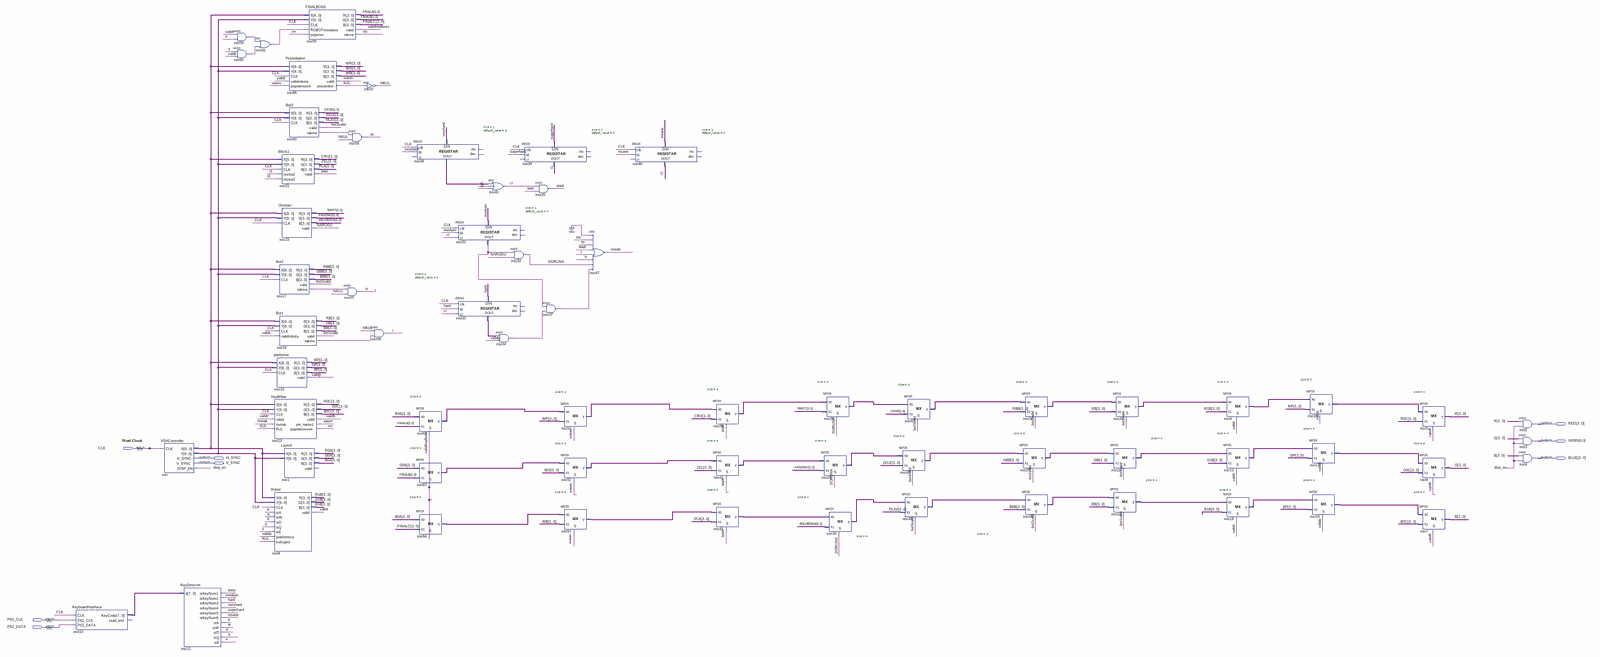
[diagram p0: schematic sheet, whole]
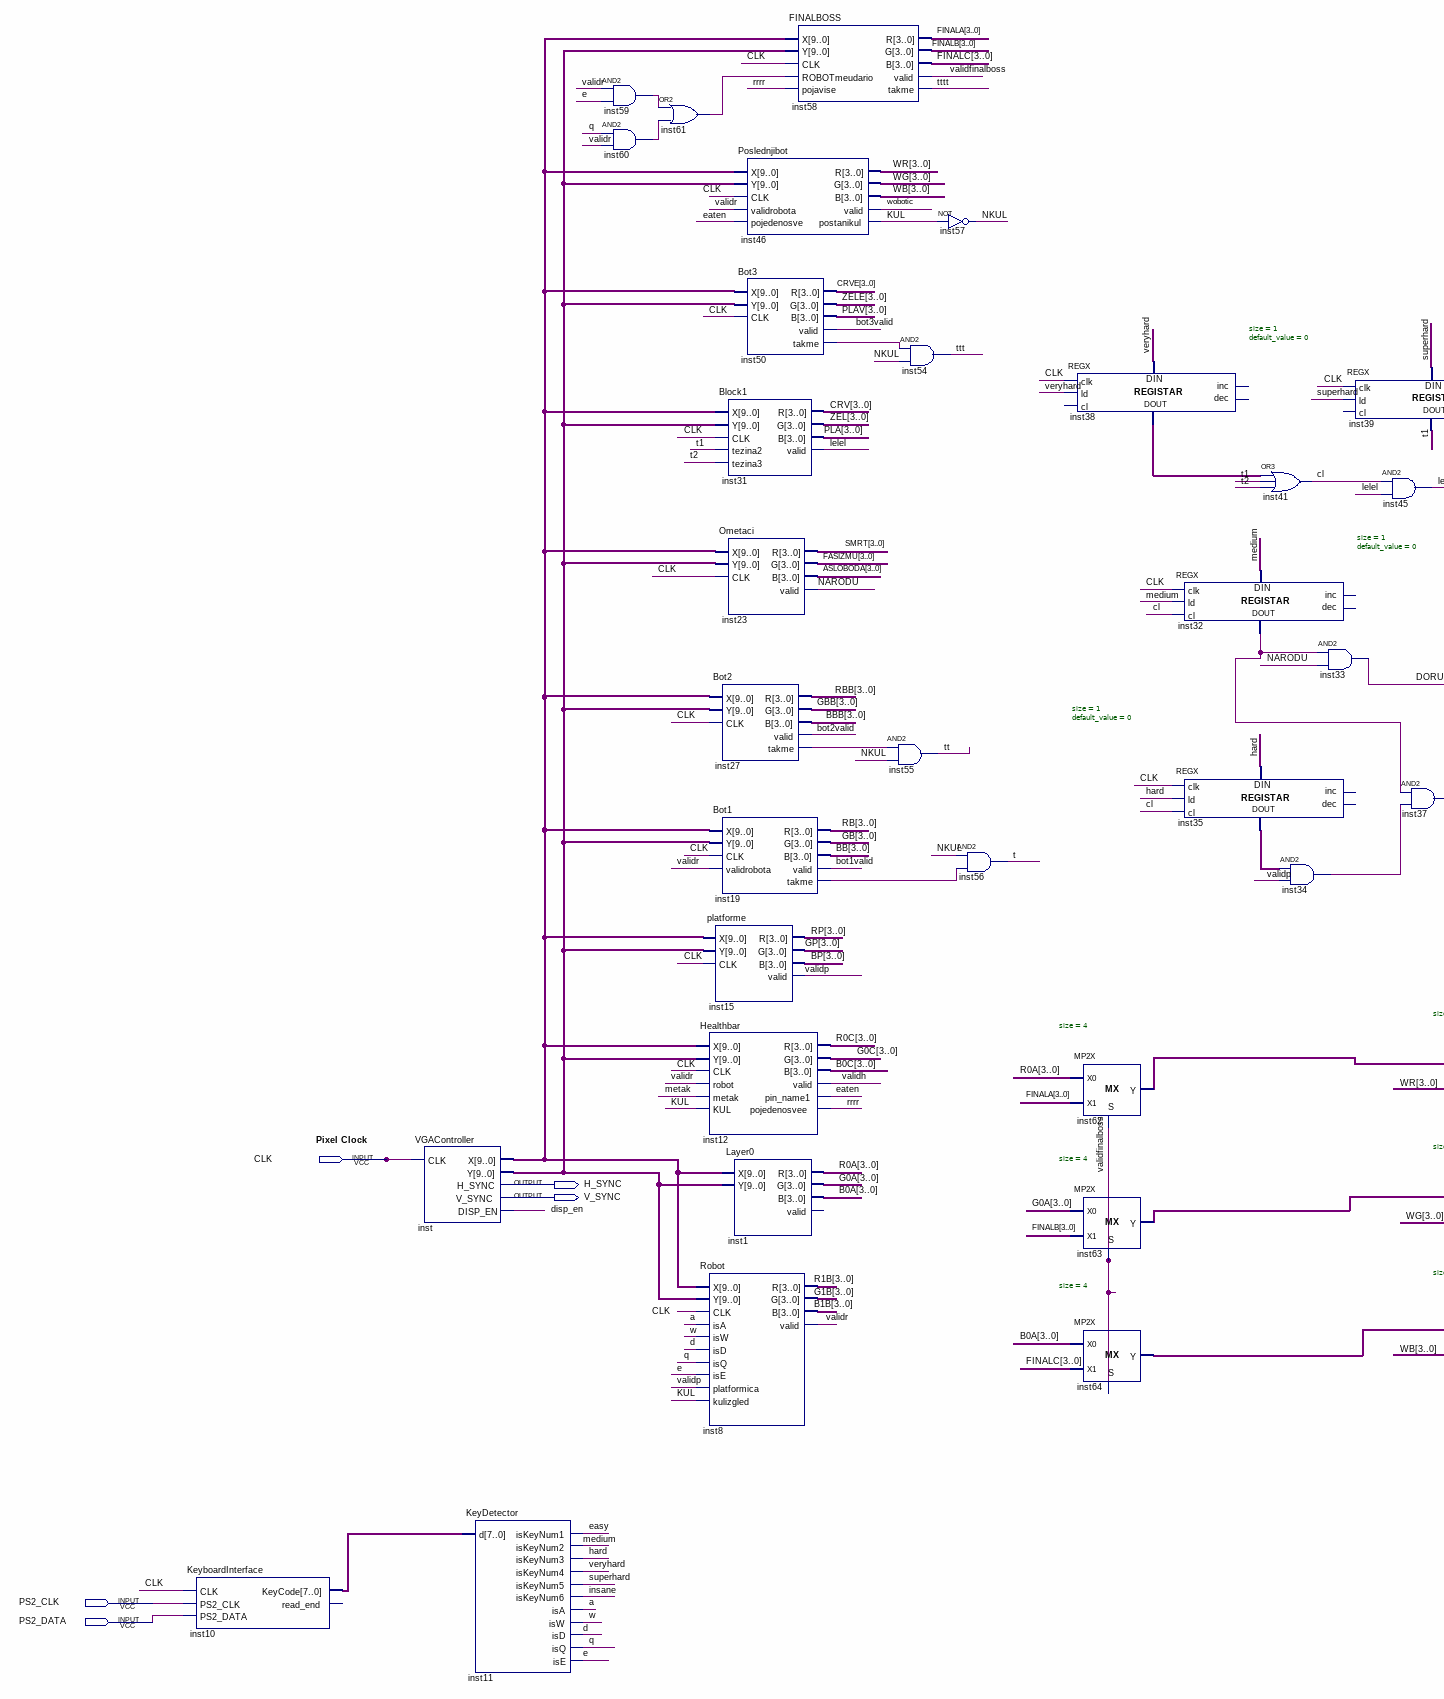
[diagram p1: schematic sheet, left part]
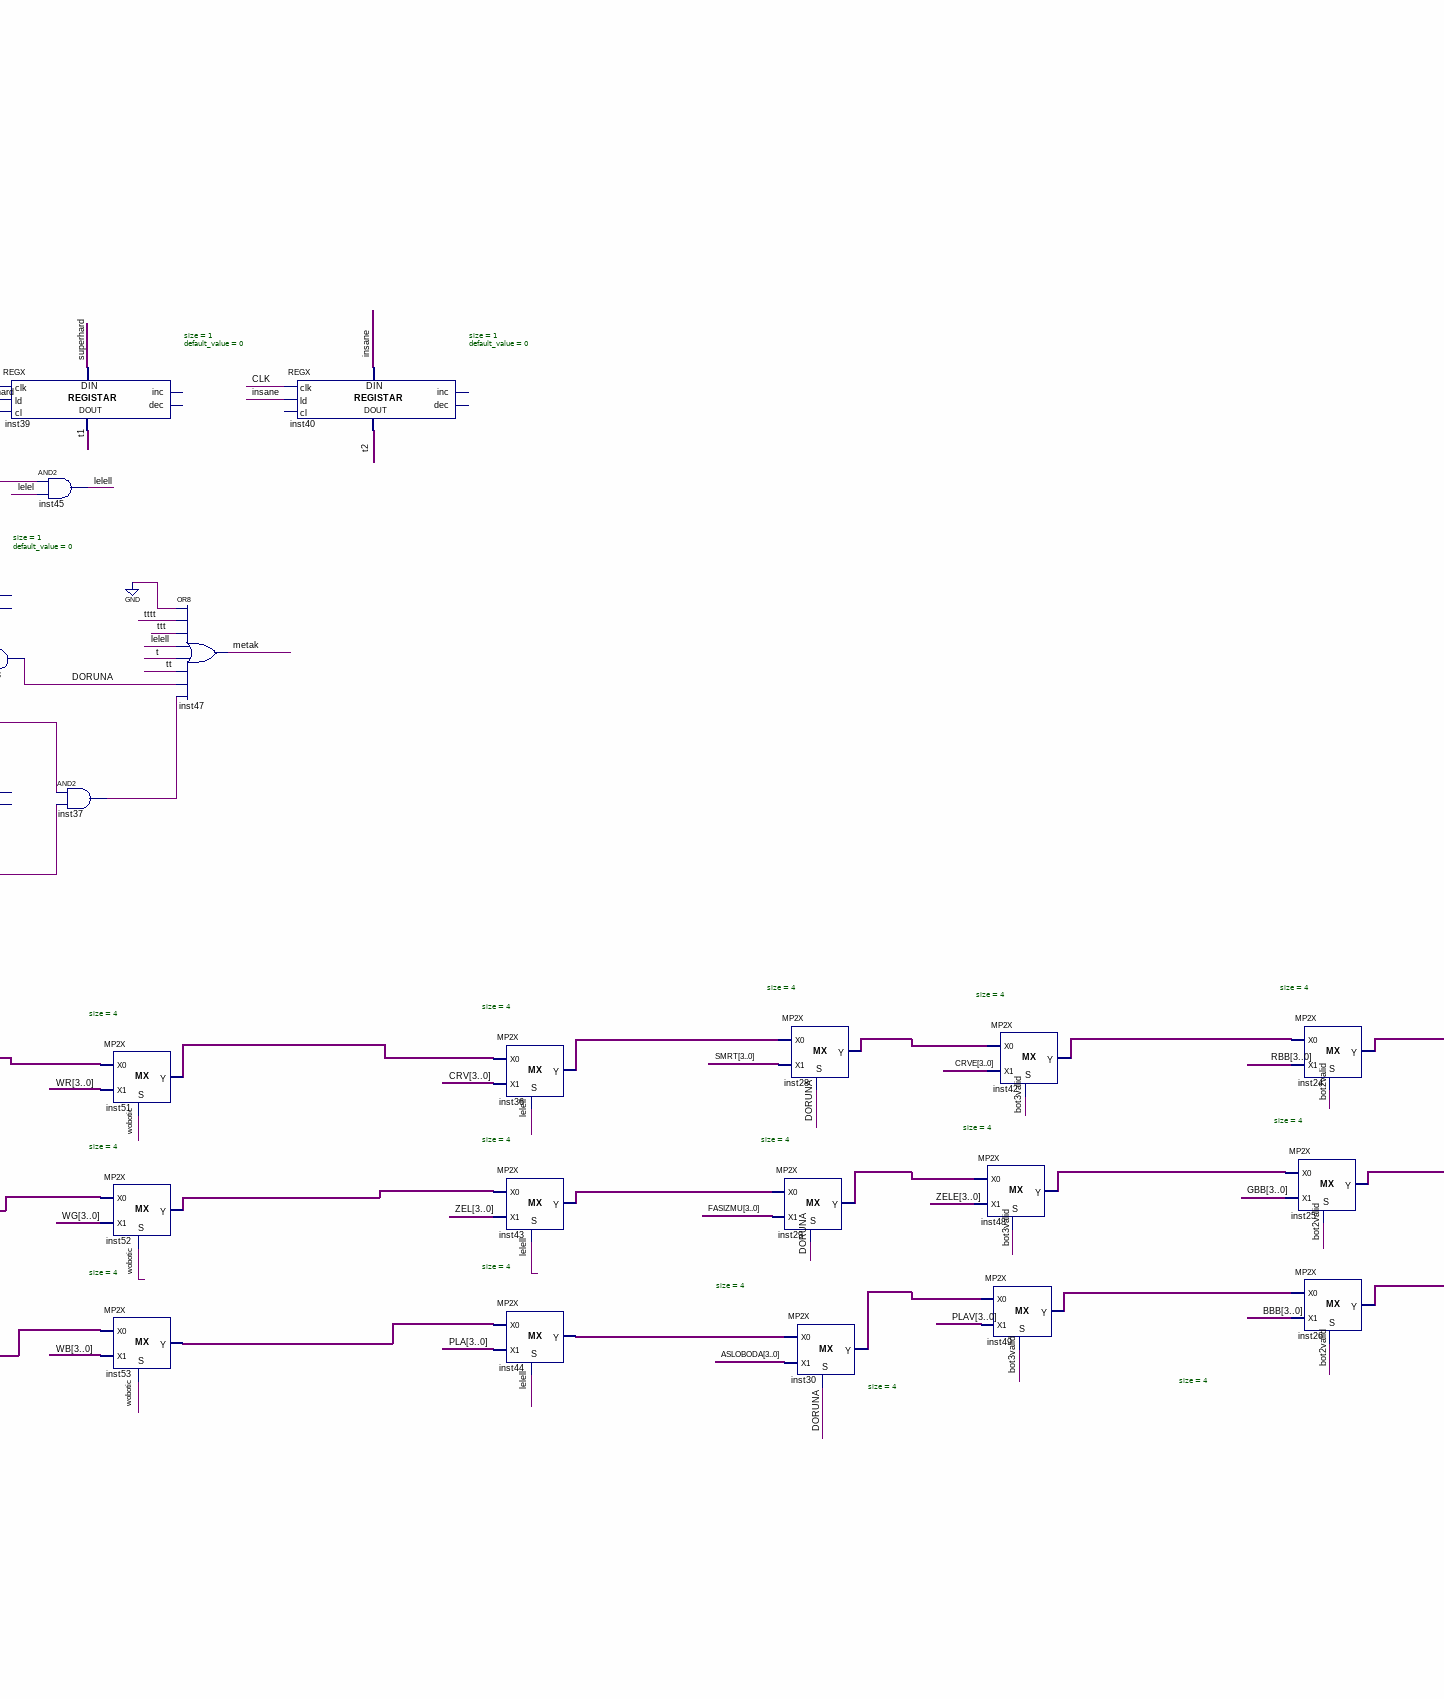
[diagram p2: schematic sheet, centre part]
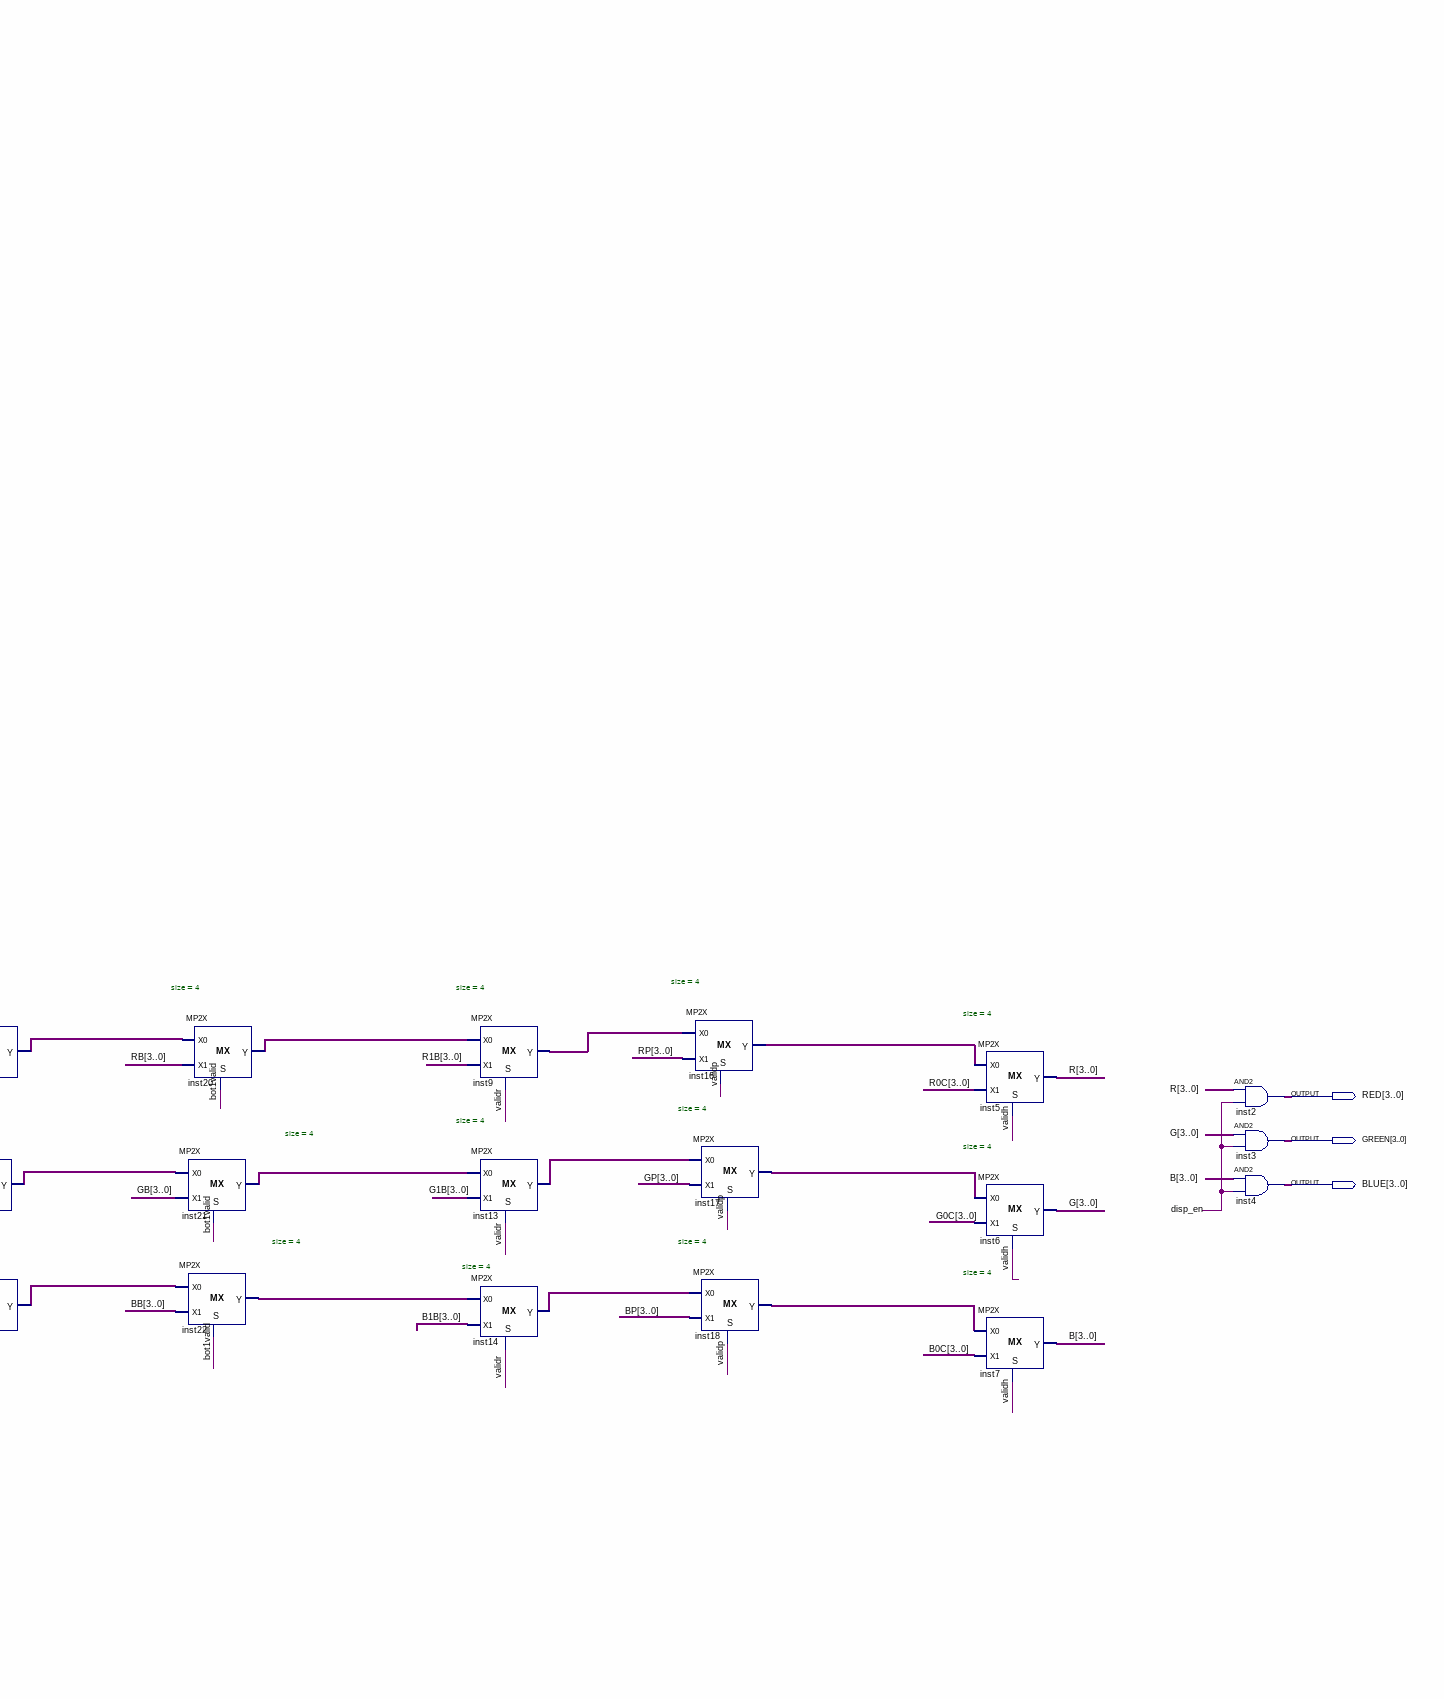
[diagram p3: schematic sheet, right part]
// Quartus schematic Lab2Demo.bdf as structural Verilog: 65 symbols, 8 pins
module Lab2Demo (
  input  CLK,
  input  PS2_CLK,
  input  PS2_DATA,
  output [3:0] RED,
  output [3:0] GREEN,
  output H_SYNC,
  output [3:0] BLUE,
  output V_SYNC
);

  wire a, bot1valid, bot2valid, bot3valid, cl, d, disp_en, DORUNA, e, easy, eaten, hard, insane,
       inst19_takme, inst27_takme, inst32_data_out, inst34_out, inst35_data_out, inst37_out, inst38_data_out,
       inst50_takme, inst59_out, inst60_out, inst61_out, KUL, lelel, lelell, \medium , metak, NARODU, NKUL,
       q, rrrr, superhard, t, t1, t2, tt, ttt, tttt, validfinalboss, validh, validp, validr, veryhard, w,
       wobotic;
  wire [3:0] ASLOBODA, B, B0A, B0C, B1B, BB, BBB, BP, CRV, CRVE, FASIZMU, FINALA, FINALB, FINALC, G, G0A,
       G0C, G1B, GB, GBB, GP, inst9_y, inst13_y, inst14_y, inst16_y, inst17_y, inst18_y, inst20_y, inst21_y,
       inst22_y, inst24_y, inst25_y, inst26_y, inst28_y, inst29_y, inst30_y, inst36_y, inst42_y, inst43_y,
       inst44_y, inst48_y, inst49_y, inst51_y, inst52_y, inst53_y, inst62_y, inst63_y, inst64_y, PLA, PLAV,
       R, R0A, R0C, R1B, RB, RBB, RP, SMRT, WB, WG, WR, ZEL, ZELE;
  wire [7:0] inst10_keycode;
  wire [9:0] inst_x, inst_y;

  KeyboardInterface inst10 (
    .CLK(CLK), .PS2_CLK(PS2_CLK), .PS2_DATA(PS2_DATA), .KeyCode(inst10_keycode));  // open: read_end
  VGAController inst (.CLK(CLK), .X(inst_x), .Y(inst_y), .H_SYNC(H_SYNC), .V_SYNC(V_SYNC), .DISP_EN(disp_en));
  KeyDetector inst11 (
    .d(inst10_keycode), .isKeyNum1(easy), .isKeyNum2(\medium ), .isKeyNum3(hard), .isKeyNum4(veryhard),
    .isKeyNum5(superhard), .isKeyNum6(insane), .isA(a), .isW(w), .isD(d), .isQ(q), .isE(e));
  and inst59 (inst59_out, validr, e);
  and inst60 (inst60_out, q, validr);
  or inst61 (inst61_out, inst59_out, inst60_out);
  Block1 inst31 (
    .X(inst_x), .Y(inst_y), .CLK(CLK), .tezina2(t1), .tezina3(t2), .R(CRV), .G(ZEL), .B(PLA), .valid(lelel));
  Ometaci inst23 (.X(inst_x), .Y(inst_y), .CLK(CLK), .R(SMRT), .G(FASIZMU), .B(ASLOBODA), .valid(NARODU));
  Bot2 inst27 (.X(inst_x), .Y(inst_y), .CLK(CLK), .R(RBB), .G(GBB), .B(BBB), .valid(bot2valid), .takme(inst27_takme));
  Bot1 inst19 (
    .X(inst_x), .Y(inst_y), .CLK(CLK), .validrobota(validr), .R(RB), .G(GB), .B(BB), .valid(bot1valid),
    .takme(inst19_takme));
  platforme inst15 (.X(inst_x), .Y(inst_y), .CLK(CLK), .R(RP), .G(GP), .B(BP), .valid(validp));
  Healthbar inst12 (
    .X(inst_x), .Y(inst_y), .CLK(CLK), .robot(validr), .metak(metak), .KUL(KUL), .R(R0C), .G(G0C), .B(B0C),
    .valid(validh), .pin_name1(eaten), .pojedenosvee(rrrr));
  Robot inst8 (
    .X(inst_x), .Y(inst_y), .CLK(CLK), .isA(a), .isW(w), .isD(d), .isQ(q), .isE(e), .platformica(validp),
    .kulizgled(KUL), .R(R1B), .G(G1B), .B(B1B), .valid(validr));
  Poslednjibot inst46 (
    .X(inst_x), .Y(inst_y), .CLK(CLK), .validrobota(validr), .pojedenosve(eaten), .R(WR), .G(WG), .B(WB),
    .valid(wobotic), .postanikul(KUL));
  Bot3 inst50 (
    .X(inst_x), .Y(inst_y), .CLK(CLK), .R(CRVE), .G(ZELE), .B(PLAV), .valid(bot3valid), .takme(inst50_takme));
  Layer0 inst1 (.X(inst_x), .Y(inst_y), .R(R0A), .G(G0A), .B(B0A));  // open: valid
  FINALBOSS inst58 (
    .X(inst_x), .Y(inst_y), .CLK(CLK), .ROBOTmeudario(inst61_out), .pojavise(rrrr), .R(FINALA), .G(FINALB),
    .B(FINALC), .valid(validfinalboss), .takme(tttt));
  and inst54 (ttt, inst50_takme, NKUL);
  and inst55 (tt, inst27_takme, NKUL);
  not inst57 (NKUL, KUL);
  and inst56 (t, NKUL, inst19_takme);
  REGX #(.size(1), .default_value(0)) inst38 (
    .clk(CLK), .ld(veryhard), .data_in(veryhard), .data_out(inst38_data_out));  // open: cl, inc, dec
  MP2X #(.size(4)) inst62 (.S(validfinalboss), .X0(R0A), .X1(FINALA), .Y(inst62_y));
  MP2X #(.size(4)) inst63 (.S(validfinalboss), .X0(G0A), .X1(FINALB), .Y(inst63_y));
  MP2X #(.size(4)) inst64 (.S(validfinalboss), .X0(B0A), .X1(FINALC), .Y(inst64_y));
  REGX #(.size(1), .default_value(0)) inst32 (
    .clk(CLK), .ld(\medium ), .cl(cl), .data_in(\medium ), .data_out(inst32_data_out));  // open: inc, dec
  REGX #(.size(1), .default_value(0)) inst35 (
    .clk(CLK), .ld(hard), .cl(cl), .data_in(hard), .data_out(inst35_data_out));  // open: inc, dec
  or inst41 (cl, inst38_data_out, t1, t2);
  and inst33 (DORUNA, inst32_data_out, NARODU);
  and inst34 (inst34_out, inst35_data_out, validp);
  REGX #(.size(1), .default_value(0)) inst39 (
    .clk(CLK), .ld(superhard), .data_in(superhard), .data_out(t1));  // open: cl, inc, dec
  and inst45 (lelell, cl, lelel);
  and inst37 (inst37_out, inst32_data_out, inst34_out);
  MP2X #(.size(4)) inst51 (.S(wobotic), .X0(inst62_y), .X1(WR), .Y(inst51_y));
  MP2X #(.size(4)) inst52 (.S(wobotic), .X0(inst63_y), .X1(WG), .Y(inst52_y));
  MP2X #(.size(4)) inst53 (.S(wobotic), .X0(inst64_y), .X1(WB), .Y(inst53_y));
  or inst47 (metak, 1'b0, tttt, ttt, lelell, t, tt, DORUNA, inst37_out);
  REGX #(.size(1), .default_value(0)) inst40 (
    .clk(CLK), .ld(insane), .data_in(insane), .data_out(t2));  // open: cl, inc, dec
  MP2X #(.size(4)) inst36 (.S(lelell), .X0(inst51_y), .X1(CRV), .Y(inst36_y));
  MP2X #(.size(4)) inst43 (.S(lelell), .X0(inst52_y), .X1(ZEL), .Y(inst43_y));
  MP2X #(.size(4)) inst44 (.S(lelell), .X0(inst53_y), .X1(PLA), .Y(inst44_y));
  MP2X #(.size(4)) inst28 (.S(DORUNA), .X0(inst36_y), .X1(SMRT), .Y(inst28_y));
  MP2X #(.size(4)) inst29 (.S(DORUNA), .X0(inst43_y), .X1(FASIZMU), .Y(inst29_y));
  MP2X #(.size(4)) inst30 (.S(DORUNA), .X0(inst44_y), .X1(ASLOBODA), .Y(inst30_y));
  MP2X #(.size(4)) inst42 (.S(bot3valid), .X0(inst28_y), .X1(CRVE), .Y(inst42_y));
  MP2X #(.size(4)) inst48 (.S(bot3valid), .X0(inst29_y), .X1(ZELE), .Y(inst48_y));
  MP2X #(.size(4)) inst49 (.S(bot3valid), .X0(inst30_y), .X1(PLAV), .Y(inst49_y));
  MP2X #(.size(4)) inst24 (.S(bot2valid), .X0(inst42_y), .X1(RBB), .Y(inst24_y));
  MP2X #(.size(4)) inst25 (.S(bot2valid), .X0(inst48_y), .X1(GBB), .Y(inst25_y));
  MP2X #(.size(4)) inst26 (.S(bot2valid), .X0(inst49_y), .X1(BBB), .Y(inst26_y));
  MP2X #(.size(4)) inst20 (.S(bot1valid), .X0(inst24_y), .X1(RB), .Y(inst20_y));
  MP2X #(.size(4)) inst21 (.S(bot1valid), .X0(inst25_y), .X1(GB), .Y(inst21_y));
  MP2X #(.size(4)) inst22 (.S(bot1valid), .X0(inst26_y), .X1(BB), .Y(inst22_y));
  MP2X #(.size(4)) inst9 (.S(validr), .X0(inst20_y), .X1(R1B), .Y(inst9_y));
  MP2X #(.size(4)) inst13 (.S(validr), .X0(inst21_y), .X1(G1B), .Y(inst13_y));
  MP2X #(.size(4)) inst14 (.S(validr), .X0(inst22_y), .X1(B1B), .Y(inst14_y));
  MP2X #(.size(4)) inst16 (.S(validp), .X0(inst9_y), .X1(RP), .Y(inst16_y));
  MP2X #(.size(4)) inst17 (.S(validp), .X0(inst13_y), .X1(GP), .Y(inst17_y));
  MP2X #(.size(4)) inst18 (.S(validp), .X0(inst14_y), .X1(BP), .Y(inst18_y));
  MP2X #(.size(4)) inst5 (.S(validh), .X0(inst16_y), .X1(R0C), .Y(R));
  MP2X #(.size(4)) inst6 (.S(validh), .X0(inst17_y), .X1(G0C), .Y(G));
  MP2X #(.size(4)) inst7 (.S(validh), .X0(inst18_y), .X1(B0C), .Y(B));
  assign RED = R & {4{disp_en}};  // AND2 inst2, 4 bits wide
  assign GREEN = G & {4{disp_en}};  // AND2 inst3, 4 bits wide
  assign BLUE = B & {4{disp_en}};  // AND2 inst4, 4 bits wide

  // Notes on the sheet:
  //   Pixel Clock
endmodule
